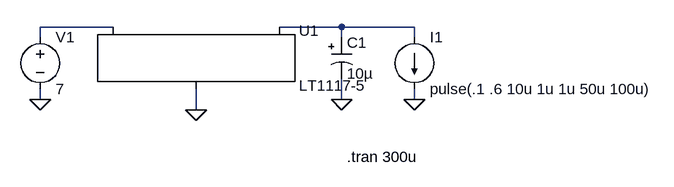
[diagram p0: schematic 1117-5.asc]
1117-5.asc, the LTspice schematic file:
Version 4
SHEET 1 1108 680
WIRE 96 176 -16 176
WIRE 448 176 352 176
WIRE 560 176 448 176
WIRE -16 192 -16 176
WIRE 448 192 448 176
WIRE 560 192 560 176
WIRE -16 288 -16 272
WIRE 448 288 448 256
WIRE 560 288 560 272
WIRE 224 304 224 272
FLAG -16 288 0
FLAG 448 288 0
FLAG 560 288 0
FLAG 224 304 0
SYMBOL polcap 432 192 R0
WINDOW 3 24 56 Left 2
SYMATTR Value 10µ
SYMATTR InstName C1
SYMATTR Description Capacitor
SYMATTR Type cap
SYMATTR SpiceLine V=33 Irms=0 Rser=0.3 Lser=0 mfg="KEMET" pn="T495D106M035AS" type="Tantalum"
SYMBOL voltage -16 176 R0
SYMATTR InstName V1
SYMATTR Value 7
SYMBOL current 560 192 R0
SYMATTR InstName I1
SYMATTR Value pulse(.1 .6 10u 1u 1u 50u 100u)
SYMBOL PowerProducts\\LT1117-5 224 176 R0
SYMATTR InstName U1
TEXT 456 376 Left 2 !.tran 300u

The netlist it stands for:
* 1117-5.asc
C1 N002 0 10µ V=33 Irms=0 Rser=0.3 Lser=0 mfg="KEMET" pn="T495D106M035AS" type="Tantalum"
V1 N001 0 7
I1 N002 0 pulse(.1 .6 10u 1u 1u 50u 100u)
XU1 0 N002 N001 LT1117-5
.tran 300u
.backanno
.end